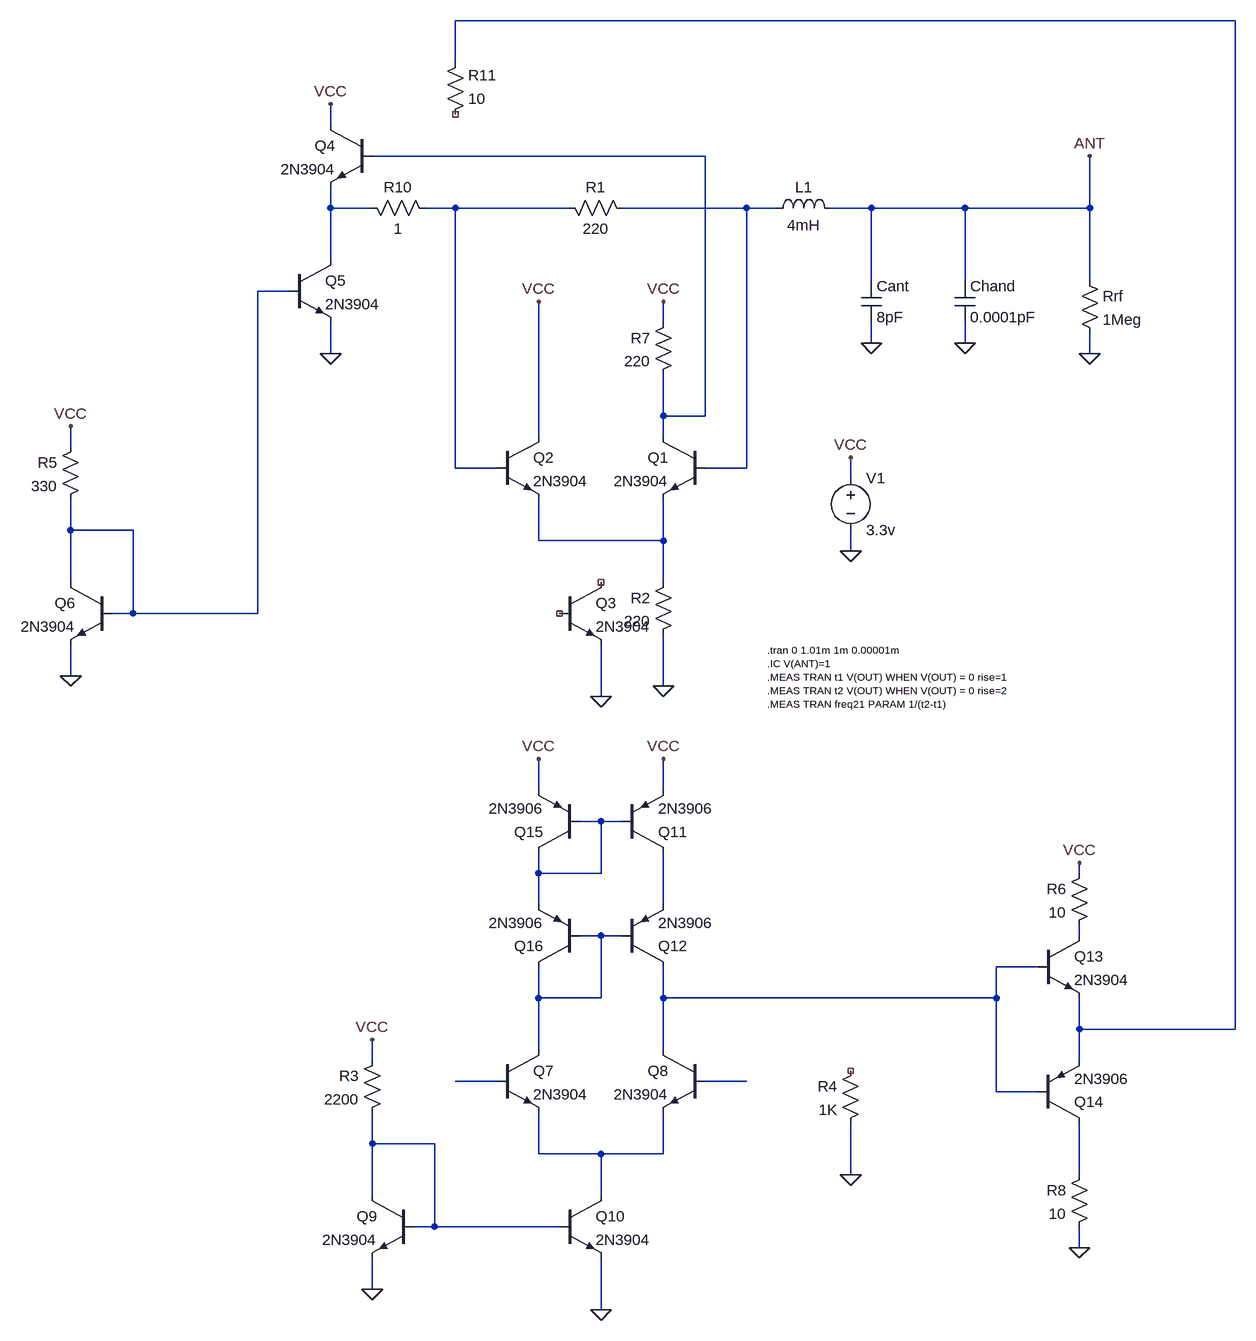
[diagram p0: schematic diff_osc_dewster_2020-11-15_experiments_v7.asc]
diff_osc_dewster_2020-11-15_experiments_v7.asc, the LTspice schematic file:
Version 4
SHEET 1 2908 1684
WIRE 1312 -320 112 -320
WIRE 112 -256 112 -320
WIRE -80 -160 -80 -192
WIRE 496 -112 -16 -112
WIRE -80 -32 -80 -64
WIRE -16 -32 -80 -32
WIRE 112 -32 64 -32
WIRE 288 -32 112 -32
WIRE 560 -32 368 -32
WIRE 608 -32 560 -32
WIRE 752 -32 688 -32
WIRE 896 -32 752 -32
WIRE 1088 -32 1088 -112
WIRE 1088 -32 896 -32
WIRE -80 48 -80 -32
WIRE 752 80 752 -32
WIRE 896 80 896 -32
WIRE 1088 80 1088 -32
WIRE -144 96 -192 96
WIRE 432 144 432 112
WIRE 752 176 752 144
WIRE 896 176 896 144
WIRE -80 192 -80 144
WIRE 1088 192 1088 160
WIRE 432 288 432 224
WIRE 496 288 496 -112
WIRE 496 288 432 288
WIRE 240 320 240 112
WIRE 432 320 432 288
WIRE -480 336 -480 304
WIRE 112 368 112 -32
WIRE 176 368 112 368
WIRE 560 368 560 -32
WIRE 560 368 496 368
WIRE 720 384 720 352
WIRE -480 464 -480 416
WIRE -384 464 -480 464
WIRE 240 480 240 416
WIRE 432 480 432 416
WIRE 432 480 240 480
WIRE 720 496 720 464
WIRE -480 544 -480 464
WIRE 432 544 432 480
WIRE -384 592 -384 464
WIRE -384 592 -416 592
WIRE -192 592 -192 96
WIRE -192 592 -384 592
WIRE -480 688 -480 640
WIRE 432 704 432 624
WIRE 336 720 336 640
WIRE 240 864 240 816
WIRE 432 864 432 816
WIRE 336 912 304 912
WIRE 368 912 336 912
WIRE 240 992 240 960
WIRE 336 992 336 912
WIRE 336 992 240 992
WIRE 1072 992 1072 976
WIRE 240 1040 240 992
WIRE 432 1040 432 960
WIRE 336 1088 304 1088
WIRE 368 1088 336 1088
WIRE 1072 1088 1072 1072
WIRE 1008 1136 944 1136
WIRE 240 1184 240 1136
WIRE 336 1184 336 1088
WIRE 336 1184 240 1184
WIRE 432 1184 432 1136
WIRE 944 1184 944 1136
WIRE 944 1184 432 1184
WIRE 1072 1232 1072 1184
WIRE 1312 1232 1312 -320
WIRE 1312 1232 1072 1232
WIRE 240 1264 240 1184
WIRE 432 1264 432 1184
WIRE -16 1280 -16 1248
WIRE 1072 1280 1072 1232
WIRE 176 1312 112 1312
WIRE 560 1312 496 1312
WIRE 944 1328 944 1184
WIRE 1008 1328 944 1328
WIRE -16 1408 -16 1360
WIRE 80 1408 -16 1408
WIRE 240 1424 240 1360
WIRE 336 1424 240 1424
WIRE 432 1424 432 1360
WIRE 432 1424 336 1424
WIRE 720 1456 720 1376
WIRE 1072 1456 1072 1376
WIRE -16 1488 -16 1408
WIRE 336 1488 336 1424
WIRE 80 1536 80 1408
WIRE 80 1536 48 1536
WIRE 272 1536 80 1536
WIRE 1072 1568 1072 1536
WIRE -16 1632 -16 1584
WIRE 336 1664 336 1584
FLAG 720 496 0
FLAG 720 352 VCC
FLAG 1088 -112 ANT
FLAG 752 176 0
FLAG 1088 192 0
FLAG -80 192 0
FLAG -480 304 VCC
FLAG -480 688 0
FLAG 336 720 0
FLAG -80 -192 VCC
FLAG 240 112 VCC
FLAG 432 112 VCC
FLAG 896 176 0
FLAG -16 1248 VCC
FLAG -16 1632 0
FLAG 336 1664 0
FLAG 240 816 VCC
FLAG 432 816 VCC
FLAG 1072 976 VCC
FLAG 720 1456 0
FLAG 1072 1568 0
FLAG 432 704 0
SYMBOL res 384 -16 M270
WINDOW 0 32 56 VTop 2
WINDOW 3 0 56 VBottom 2
SYMATTR InstName R1
SYMATTR Value 220
SYMBOL voltage 720 368 R0
WINDOW 123 0 0 Left 2
WINDOW 39 0 0 Left 2
SYMATTR InstName V1
SYMATTR Value 3.3v
SYMBOL npn 176 320 R0
SYMATTR InstName Q2
SYMATTR Value 2N3904
SYMBOL ind 592 -16 R270
WINDOW 0 32 56 VTop 2
WINDOW 3 5 56 VBottom 2
SYMATTR InstName L1
SYMATTR Value 4mH
SYMATTR SpiceLine Rser=120 Cpar=1.2pF
SYMBOL cap 736 80 R0
SYMATTR InstName Cant
SYMATTR Value 8pF
SYMBOL npn 496 320 M0
SYMATTR InstName Q1
SYMATTR Value 2N3904
SYMBOL npn -16 -160 M0
SYMATTR InstName Q4
SYMATTR Value 2N3904
SYMBOL res 1072 64 R0
SYMATTR InstName Rrf
SYMATTR Value 1Meg
SYMBOL res -464 320 M0
SYMATTR InstName R5
SYMATTR Value 330
SYMBOL npn -144 48 R0
SYMATTR InstName Q5
SYMATTR Value 2N3904
SYMBOL npn -416 544 M0
SYMATTR InstName Q6
SYMATTR Value 2N3904
SYMBOL npn 272 544 R0
SYMATTR InstName Q3
SYMATTR Value 2N3904
SYMBOL res 448 128 M0
SYMATTR InstName R7
SYMATTR Value 220
SYMBOL cap 880 80 R0
SYMATTR InstName Chand
SYMATTR Value 0.0001pF
SYMBOL npn 176 1264 R0
SYMATTR InstName Q7
SYMATTR Value 2N3904
SYMBOL npn 496 1264 M0
SYMATTR InstName Q8
SYMATTR Value 2N3904
SYMBOL res 0 1264 M0
SYMATTR InstName R3
SYMATTR Value 2200
SYMBOL npn 48 1488 M0
SYMATTR InstName Q9
SYMATTR Value 2N3904
SYMBOL npn 272 1488 R0
SYMATTR InstName Q10
SYMATTR Value 2N3904
SYMBOL npn 1008 1088 R0
SYMATTR InstName Q13
SYMATTR Value 2N3904
SYMBOL res 736 1280 M0
SYMATTR InstName R4
SYMATTR Value 1K
SYMBOL pnp 1008 1376 M180
SYMATTR InstName Q14
SYMATTR Value 2N3906
SYMBOL res 1088 976 M0
SYMATTR InstName R6
SYMATTR Value 10
SYMBOL res 1088 1440 M0
SYMATTR InstName R8
SYMATTR Value 10
SYMBOL res 80 -16 M270
WINDOW 0 32 56 VTop 2
WINDOW 3 0 56 VBottom 2
SYMATTR InstName R10
SYMATTR Value 1
SYMBOL res 96 -160 M180
WINDOW 0 36 76 Left 2
WINDOW 3 36 40 Left 2
SYMATTR InstName R11
SYMATTR Value 10
SYMBOL pnp 368 960 M180
SYMATTR InstName Q11
SYMATTR Value 2N3906
SYMBOL pnp 368 1136 M180
SYMATTR InstName Q12
SYMATTR Value 2N3906
SYMBOL pnp 304 960 R180
SYMATTR InstName Q15
SYMATTR Value 2N3906
SYMBOL pnp 304 1136 R180
SYMATTR InstName Q16
SYMATTR Value 2N3906
SYMBOL res 448 528 M0
SYMATTR InstName R2
SYMATTR Value 220
TEXT 592 648 Left 1 !.tran 0 1.01m 1m 0.00001m\n.IC V(ANT)=1\n.MEAS TRAN t1 V(OUT) WHEN V(OUT) = 0 rise=1\n.MEAS TRAN t2 V(OUT) WHEN V(OUT) = 0 rise=2\n.MEAS TRAN freq21 PARAM 1/(t2-t1)

The netlist it stands for:
* diff_osc_dewster_2020-11-15_experiments_v7.asc
R1 N005 N004 220
V1 VCC 0 3.3v
Q2 VCC N004 N007 0 2N3904
L1 N005 ANT 4mH Rser=120 Cpar=1.2pF
Cant ANT 0 8pF
Q1 N002 N005 N007 0 2N3904
Q4 VCC N002 N003 0 2N3904
Rrf ANT 0 1Meg
R5 VCC N006 330
Q5 N003 N006 0 0 2N3904
Q6 N006 N006 0 0 2N3904
Q3 NC_01 NC_02 0 0 2N3904
R7 VCC N002 220
Chand ANT 0 0.0001pF
Q7 N010 N013 N016 0 2N3904
Q8 N012 N014 N016 0 2N3904
R3 VCC N015 2200
Q9 N015 N015 0 0 2N3904
Q10 N016 N015 0 0 2N3904
Q13 N011 N012 N001 0 2N3904
R4 NC_03 0 1K
Q14 N017 N012 N001 0 2N3906
R6 VCC N011 10
R8 N017 0 10
R10 N004 N003 1
R11 NC_04 N001 10
Q11 N009 N008 VCC 0 2N3906
Q12 N012 N010 N009 0 2N3906
Q15 N008 N008 VCC 0 2N3906
Q16 N010 N010 N008 0 2N3906
R2 N007 0 220
.model NPN NPN
.model PNP PNP
.lib standard.bjt
.tran 0 1.01m 1m 0.00001m
.IC V(ANT)=1
.MEAS TRAN t1 V(OUT) WHEN V(OUT) = 0 rise=1
.MEAS TRAN t2 V(OUT) WHEN V(OUT) = 0 rise=2
.MEAS TRAN freq21 PARAM 1/(t2-t1)
.backanno
.end